# Altium project EL.T01.UIM.PrjPcb
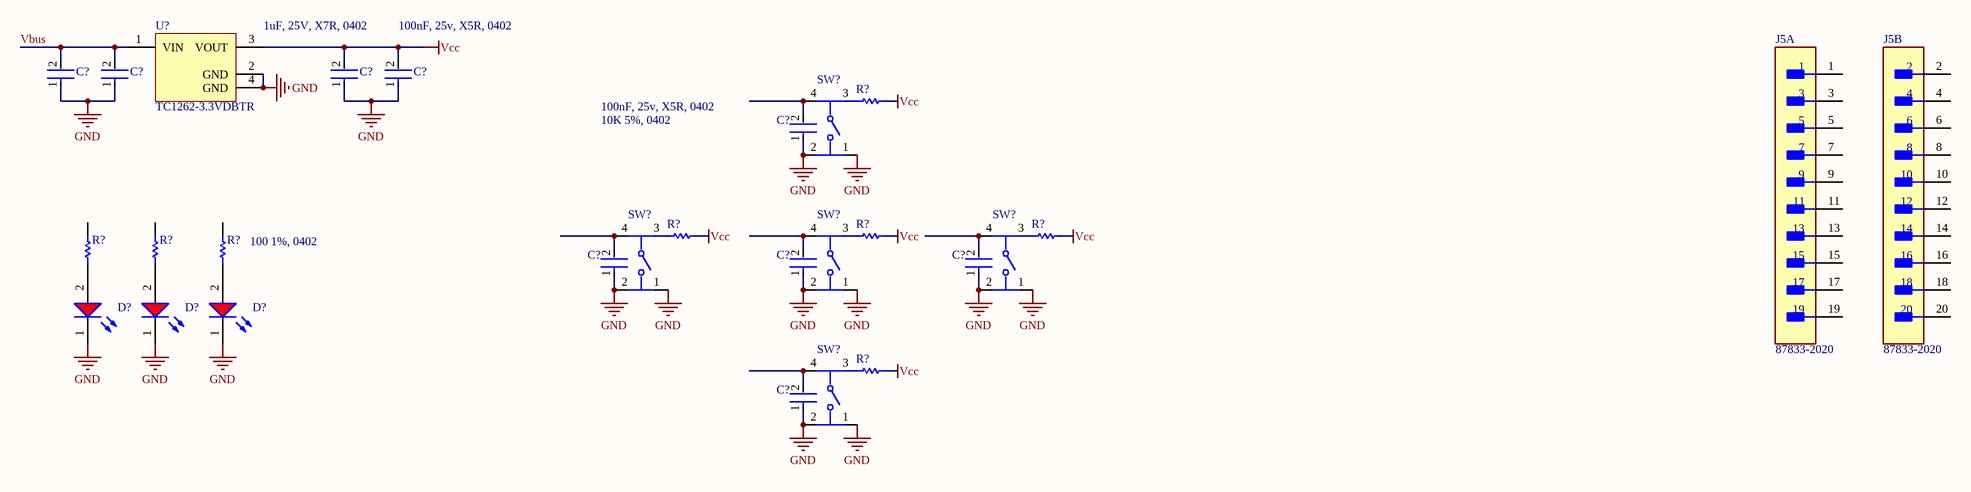
[diagram p0: UI.SchDoc]
1 sheet, 27 parts. Net scope: global (net labels, ports and power ports of the same name join across sheets).

## Sheet UI.SchDoc
size A3; SheetNumber: 1; SheetTotal: 1

### Parts
(Parts that share a designator on the sheet are numbered #1, #2 ... from top to bottom, then left to right.)
C?#1  1uF, 25V, X7R, 0402  [FP-GRM155-0_05-IPC_B]  (value not drawn)
C?#2  100nF, 25v, X5R, 0402  [FP-GRM155-0_05-IPC_C]  (value not drawn)
C?#3  100nF, 25v, X5R, 0402  [FP-GRM155-0_05-IPC_C]  (value not drawn)
C?#4  1uF, 25V, X7R, 0402  [FP-GRM155-0_05-IPC_B]  (value not drawn)
C?#5  100nF, 25v, X5R, 0402  [FP-GRM155-0_05-IPC_C]  (value not drawn)
C?#6  100nF, 25v, X5R, 0402  [FP-GRM155-0_05-IPC_C]  (value not drawn)
C?#7  100nF, 25v, X5R, 0402  [FP-GRM155-0_05-IPC_C]  (value not drawn)
C?#8  100nF, 25v, X5R, 0402  [FP-GRM155-0_05-IPC_C]  (value not drawn)
C?#9  100nF, 25v, X5R, 0402  [FP-GRM155-0_05-IPC_C]  (value not drawn)
D?#1  150060RS75000  [WL-SMCW_0603_150060xx75000]  (value not drawn)
D?#2  150060RS75000  [WL-SMCW_0603_150060xx75000]  (value not drawn)
D?#3  150060RS75000  [WL-SMCW_0603_150060xx75000]  (value not drawn)
J5  87833-2020  [FP-87833-2020-MFG]  (parts A,B of 2)
R?#1  10K 5%, 0402  [RESC1005X40X25ML05T05]  (value not drawn)
R?#2  10K 5%, 0402  [RESC1005X40X25ML05T05]  (value not drawn)
R?#3  10K 5%, 0402  [RESC1005X40X25ML05T05]  (value not drawn)
R?#4  10K 5%, 0402  [RESC1005X40X25ML05T05]  (value not drawn)
R?#5  100 1%, 0402  [RESC1005X40X25LL05T05]  (value not drawn)
R?#6  100 1%, 0402  [RESC1005X40X25LL05T05]  (value not drawn)
R?#7  100 1%, 0402  [RESC1005X40X25LL05T05]  (value not drawn)
R?#8  10K 5%, 0402  [RESC1005X40X25ML05T05]  (value not drawn)
SW?#1  PTS645SM43SMTR92LFS  [FP-PTS645SM43SMTR92LFS-MFG]  (value not drawn)
SW?#2  PTS645SM43SMTR92LFS  [FP-PTS645SM43SMTR92LFS-MFG]  (value not drawn)
SW?#3  PTS645SM43SMTR92LFS  [FP-PTS645SM43SMTR92LFS-MFG]  (value not drawn)
SW?#4  PTS645SM43SMTR92LFS  [FP-PTS645SM43SMTR92LFS-MFG]  (value not drawn)
SW?#5  PTS645SM43SMTR92LFS  [FP-PTS645SM43SMTR92LFS-MFG]  (value not drawn)
U?  TC1262-3.3VDBTR  [SOT-223-DB3_M]

### Nets
GND: C?#1.1 C?#2.1 C?#3.1 C?#4.1 C?#5.1 C?#6.1 C?#7.1 C?#8.1 C?#9.1 D?#1.1(K) D?#2.1(K) D?#3.1(K) SW?#1.1 SW?#1.2 SW?#2.1 SW?#2.2 SW?#3.1 SW?#3.2 SW?#4.1 SW?#4.2 SW?#5.1 SW?#5.2 U?.2(GND) U?.4(GND)
Vcc: C?#3.2 C?#4.2 R?#1.1 R?#2.1 R?#3.1 R?#4.1 R?#8.1 U?.3(VOUT)
Vbus: C?#1.2 C?#2.2 U?.1(VIN)
NetC?#5_2: C?#5.2 SW?#1.4
NetC?#6_2: C?#6.2 SW?#2.4
NetC?#7_2: C?#7.2 SW?#3.4
NetC?#8_2: C?#8.2 SW?#4.4
NetC?#9_2: C?#9.2 SW?#5.4
NetD?#1_2: D?#1.2(A) R?#5.1
NetD?#2_2: D?#2.2(A) R?#6.1
NetD?#3_2: D?#3.2(A) R?#7.1
NetR?#1_2: R?#1.2 SW?#1.3
NetR?#2_2: R?#2.2 SW?#2.3
NetR?#3_2: R?#3.2 SW?#3.3
NetR?#4_2: R?#4.2 SW?#4.3
NetR?#8_2: R?#8.2 SW?#5.3

Not connected (* = marked no-connect by the designer): J5 1 2 3 4 5 6 7 8 9 10 11 12 13 14 15 16 17 18 19 20; R?#5 2; R?#6 2; R?#7 2

### Notes on the sheet
- 1uF, 25V, X7R, 0402
- (near C?#4) 100nF, 25v, X5R, 0402
- 10K 5%, 0402
- 100nF, 25v, X5R, 0402
- (near R?#7) 100 1%, 0402

### Library data of the parts
C?#1 C?#4 = CMP-2008-04581-2: Chip Multilayer Ceramic Capacitors for General Purpose, 0402, 1.0uF, X5R, 15%, 10%, 25V; Height: 0.5mm; Voltage: 25V; Tolerance: 10%; Termination: SMD/SMT; Dielectric: X5R; REACH SVHC: No SVHC; Case Code (Imperial): 0402; Max Operating Temperature: 85°C; Lead Free: Lead Free; Case/Package: 0402; Mount: Surface Mount; Width: 0.5mm; Weight: 0.000212oz; Min Operating Temperature: -55°C; Voltage Rating (DC): 25V; Length: 1mm; Thickness: 0.022inch; Voltage Rating: 25V; Material: Ceramic; Case Code (Metric): 1005; Package Quantity: 10000; Packaging: Tape and Reel; Depth: 0.5mm; Capacitance: 1uF
C?#2 C?#3 C?#5-C?#9 = CMP-06035-003661-1: Chip Multilayer Ceramic Capacitors for General Purpose, 0402, 0.10uF, X7R, 15%, 10%, 25V; Length: 1mm; Depth: 0.5mm; Dielectric: X7R; Voltage Rating: 25V; Lead Free: Lead Free; Case Code (Imperial): 0402; Voltage: 25V; Min Operating Temperature: -55°C; Tolerance: 10%; Dielectric Material: Ceramic; Voltage Rating (DC): 25V; Max Operating Temperature: 125°C; Capacitance: 100nF; Thickness: 0.022inch; Case/Package: 0402; Height: 0.5mm; Resistor Type: Ceramic; Weight: 0.000212oz; Case Code (Metric): 1005; Package Quantity: 10000; Termination: SMD/SMT; Width: 0.02inch; Mount: Surface Mount; Packaging: Tape and Reel
D?#1-D?#3 = CMP-1426-00001-4: LED Low-Power Uni-Color Red 630nm 2V 2-Pin Chip 0603(1608Metric) T/R; Max Junction Temperature (Tj): 95°C; Dominant Wavelength: 625nm; Lens Style: Clear, Rectangular; Viewing Angle: 140°; Forward Current: 100mA; Max Reverse Voltage (DC): 5V; Luminous Intensity: 250mcd; Test Current: 20mA; Power Dissipation: 72mW; Max Operating Temperature: 85°C; Mount: Surface Mount; Height: 700µm; Packaging: Tape and Reel; REACH SVHC: Unknown; Case Code (Metric): 1608; Peak Wavelength: 630nm; Forward Voltage: 2V; Case/Package: 0603; Color: Red; RoHS: Compliant; Width: 800µm; Reverse Voltage: 5V; Min Operating Temperature: -40°C; Wavelength: 625nm; Case Code (Imperial): 0603; Length: 1.6mm
J5 = CMP-00257-00277225-1: 87833-2020 Conn Shrouded Header (4 Sides) HDR 20 POS 2mm Solder RA Side Entry Thru-Hole Milli-Grid™ Tube; NexarPartId: 277225; Shrouded: Yes RoHS Compliant: Yes; Glow Wire Compliant: Non-compliant; Gender: Male; Number of Contacts: 20; Insulation Resistance: 1GΩ; Voltage Rating: 125V; Current Rating: 2A; Number of Rows: 2; Housing Color: Black; Orientation: Right Angle; RoHS: Compliant; Lead Pitch: 2mm; Flammability Rating: UL94 V-0; Contact Gender: Male; Min Operating Temperature: -55°C; Number of Circuits: 20; Max Operating Temperature: 105°C; Lead Free: Lead Free; Color: Black; Housing Material: Thermoplastic; Contact Plating: Gold; Number of Positions: 20; Row Spacing: 2mm; Termination: Solder; Contact Material: Brass; Mount: Through Hole; Height: 6.5mm; Voltage Rating (DC): 125V; Radiation Hardening: No; Pitch: 2mm; Schedule B: 8536694040
R?#1-R?#4 R?#8 = CMP-2002-00433-1: Part Number: ERJ-2GEJ103X; Manufacturer: Panasonic
R?#5-R?#7 = CMP-2002-00605-3: Chip Resistor, 100 Ohm, +/- 1%, 100 mW, -55 to 155 degC, 0402 (1005 Metric), RoHS, Tape and Reel; Manufacturer: Basic Passives; PartNumber: ERJ-2RKF1000X; Power Rating: 100 mW; Resistance: 100 Ohm; Voltage Rating: 50 V; Case\/Package: 0402; Width: 0.5 mm; Pins: 2; ComponentLink2Description: Datasheet; PackageReference: 0402; Height: 0.35 mm; Tolerance: 1%; DatasheetVersion: 04/2015; Case Code (Imperial): 0402; Min Operating Temperature: -55 degC; Radiation Hardening: No; Length: 1 mm; Package Quantity: 10000; PackageDescription: 2-Pin Surface Mount Device, Body 1 x 0.5 mm; Mounting Technology: Surface Mount; Case Code (Metric): 1005; Packaging: Tape and Reel; ComponentLink1URL: http://www.panasonic.com/; RoHSCompliant: true; Max Operating Temperature: 155 degC; REACH SVHC: Yes; ComponentLink1Description: Manufacturer URL; ComponentLink2URL: http://industrial.panasonic.com/cdbs/www-data/pdf/RDA0000/AOA0000C86.pdf; Mount: Surface Mount
SW?#1-SW?#5 = CMP-2000-05160-2: SWITCH TACTILE SPST-NO 0.05A 12V; Contact Resistance: 100mR; Throw Configuration: SPST; Illumination Type: Non-Illuminated; Mechanical Life: 100000Cycles; Current Rating: 50mA; Switch Function: Off-Mom; Actuator Length: 0.85mm; Actuator Material: Nylon; Actuator Type: Standard; Operating Force: 160gf; Min Operating Temperature: -20°C; REACH SVHC: No SVHC; Termination: Gull Wing; Case/Package: SMD/SMT; Packaging: Tape and Reel; Mount: Surface Mount; Voltage Rating (DC): 12V; Orientation: Straight; Lead Free: Lead Free; Contact Material: Silver; Color: Black; Max Current Rating: 50mA; Contact Plating: Silver; Depth: 9mm; Package Quantity: 1; Max Voltage Rating (DC): 12V; Length: 6mm; Max Operating Temperature: 60°C
U? = CMP-0136-00481-1: 500mA Fixed Output CMOS LDO, 3-Pin SOT-223, Extended Temperature, Tape and Reel; PackageVersion: revBB, Aug-2009; PackageDescription: 3-Lead Plastic Small Outline Transistor (DB) [SOT-223]; DatasheetVersion: revB, 2002; PackageReference: SOT-223-DB3